# EAGLE schematic projet_electronique (EAGLE 7.2.0)
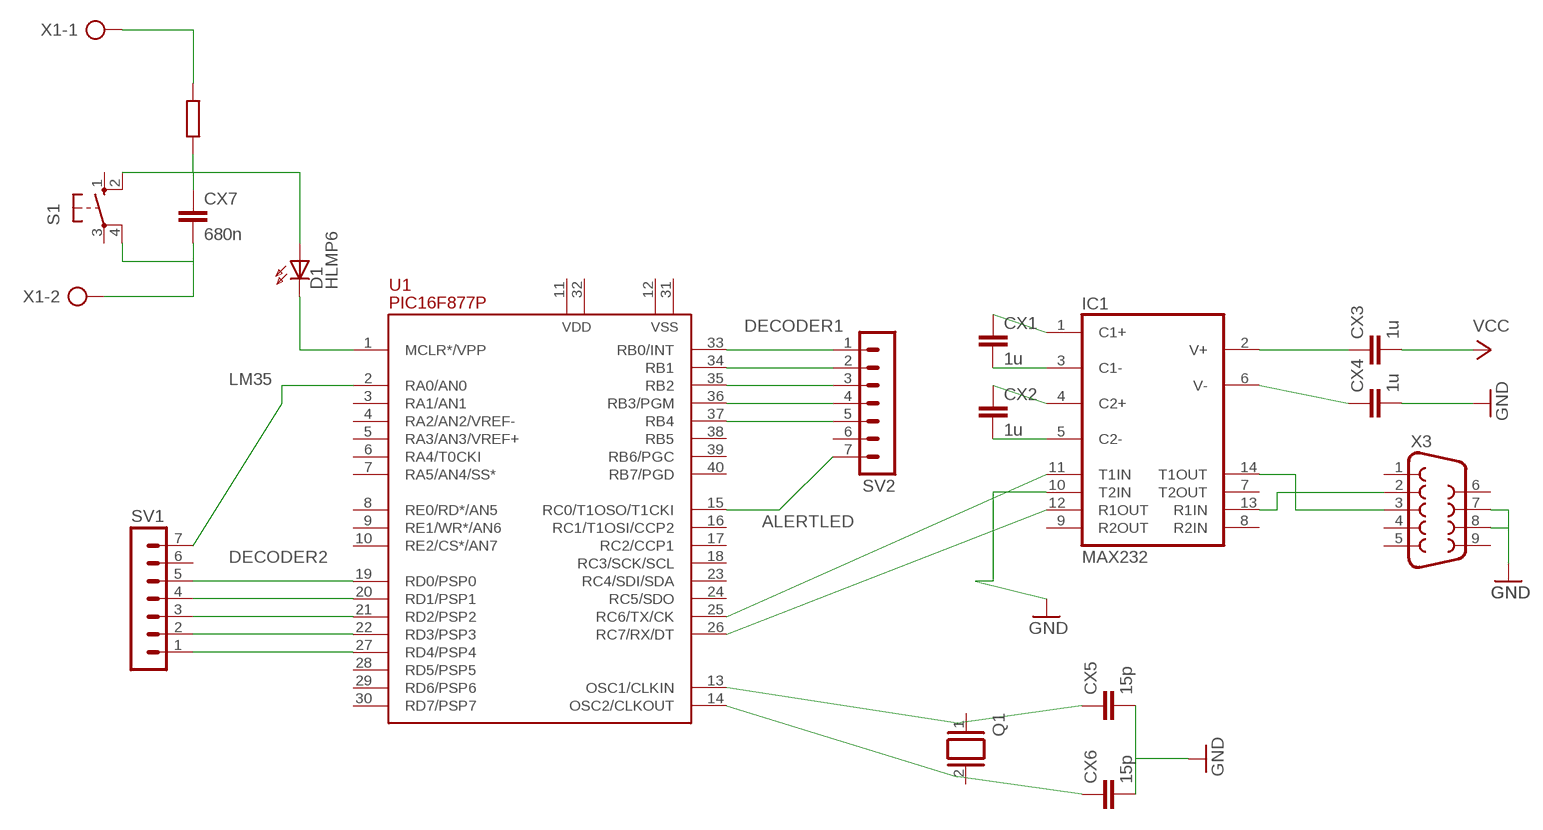
[diagram p0: schematic, sheet 1]

## Parts
CX1  1u  CXXC10B5  [XC10B5]
CX2  1u  CXXC10B5  [XC10B5]
CX3  1u  CXXC10B5  [XC10B5]
CX4  1u  CXXC10B5  [XC10B5]
CX5  15p  CXXC10B5  [XC10B5]
CX6  15p  CXXC10B5  [XC10B5]
CX7  680n  CXXC10B5  [XC10B5]
D1  HLMP6  [HLMP6]
IC1  MAX232  [DIL16]
Q1  XTAL  [Q]
S1  10-XX  [B3F-10XX]
SV1  MA07-1  [MA07-1]
SV2  MA07-1  [MA07-1]
U1  PIC16F877P  [DIL40]
X1  AK500/2-H  [AK500/2-H]
X3  F09V  [F09V]

## Nets
ALERTLED: SV2.7 U1.15(RC0/T1OSO/T1CKI)
DECODER1: SV2.1 U1.33(RB0/INT)
DECODER2: SV1.5 U1.19(RD0/PSP0)
GND: CX4.2 CX5.2 CX6.2 IC1.10(T2IN) X3.7 X3.8
LM35: SV1.7 U1.2(RA0/AN0)
N$1: X1.1
N$2: CX7.1 D1.A S1.2(S1)
N$3: D1.K U1.1(MCLR*/VPP)
N$4: CX5.1 U1.13(OSC1/CLKIN)
N$5: CX1.1 IC1.1(C1+)
N$6: CX7.2 S1.4(P1) X1.2
N$7: CX6.1 U1.14(OSC2/CLKOUT)
N$8: CX1.2 IC1.3(C1-)
N$9: CX2.1 IC1.4(C2+)
N$10: CX2.2 IC1.5(C2-)
N$11: CX3.1 IC1.2(V+)
N$12: CX4.1 IC1.6(V-)
N$13: IC1.11(T1IN) U1.25(RC6/TX/CK)
N$14: IC1.12(R1OUT) U1.26(RC7/RX/DT)
N$16: IC1.14(T1OUT) X3.3
N$17: IC1.13(R1IN) X3.2
N$18: SV2.2 U1.34(RB1)
N$19: SV2.3 U1.35(RB2)
N$20: SV2.4 U1.36(RB3/PGM)
N$21: SV2.5 U1.37(RB4)
N$22: SV1.4 U1.20(RD1/PSP1)
N$23: SV1.3 U1.21(RD2/PSP2)
N$24: SV1.2 U1.22(RD3/PSP3)
N$25: SV1.1 U1.27(RD4/PSP4)
VCC: CX3.2
Unconnected: IC1.7(T2OUT) IC1.8(R2IN) IC1.9(R2OUT) Q1.1 Q1.2 S1.1(S) S1.3(P) SV1.6 SV2.6 U1.3(RA1/AN1) U1.4(RA2/AN2/VREF-) U1.5(RA3/AN3/VREF+) U1.6(RA4/T0CKI) U1.7(RA5/AN4/SS*) U1.8(RE0/RD*/AN5) U1.9(RE1/WR*/AN6) U1.10(RE2/CS*/AN7) U1.11(VDD) U1.12(VSS) U1.16(RC1/T1OSI/CCP2) U1.17(RC2/CCP1) U1.18(RC3/SCK/SCL) U1.23(RC4/SDI/SDA) U1.24(RC5/SDO) U1.28(RD5/PSP5) U1.29(RD6/PSP6) U1.30(RD7/PSP7) U1.31(VSS) U1.32(VDD) U1.38(RB5) U1.39(RB6/PGC) U1.40(RB7/PGD) X3.1 X3.4 X3.5 X3.6 X3.9

## Power pins joined to a net without a drawn wire
GND: IC1.15(GND)
VCC: IC1.16(VCC)

## Library data of the parts
CX1-CX7 = rcl:CX: X CAPACITOR for power line
D1 = display-hp:HLMP6: LED 2mm horizontal; MF: AGILENT TECHNOLOGIES; MPN: HLMP-6500; OC_FARNELL: 1652490; OC_NEWARK: 40K0088
IC1 = maxim:MAX232: RS232 TRANSCEIVER; MF: MAXIM; MPN: MAX232ACPE+; OC_FARNELL: 9723773; OC_NEWARK: 68K4544
Q1 = special:XTAL: CRYSTAL
S1 = switch-omron:10-XX: OMRON SWITCH; MPN: B3F-1000; OC_FARNELL: 176432; OC_NEWARK: 36M3542
SV1 SV2 = con-lstb:MA07-1: PIN HEADER; OC_FARNELL: unknown; OC_NEWARK: unknown
U1 = pic16f87x:PIC16F877: FLASH MICROCONTROLLER
X1 = con-ptr500:AK500/2-H: CONNECTOR Aug. 2004 / PTR Meßtechnik: Die Bezeichnung der Serie AK505 wurde geändert. Es handelt sich hierbei um AK500 in horizontaler Ausführung.; OC_FARNELL: unknown; OC_NEWARK: unknown
X3 = con-subd:F09: SUB-D; OC_FARNELL: unknown; OC_NEWARK: unknown